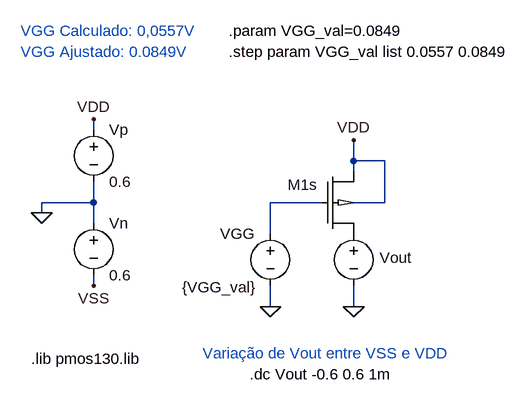
[diagram p0: schematic FiguraA_Questao2.asc]
FiguraA_Questao2.asc, the LTspice schematic file:
Version 4.1
SHEET 1 968 680
WIRE -144 -160 -144 -176
WIRE 256 -112 256 -144
WIRE 304 -112 256 -112
WIRE 256 -96 256 -112
WIRE -144 -48 -144 -80
WIRE -144 -48 -224 -48
WIRE 208 -48 128 -48
WIRE 304 -48 304 -112
WIRE 304 -48 256 -48
WIRE -224 -32 -224 -48
WIRE -144 -16 -144 -48
WIRE 128 0 128 -48
WIRE -144 80 -144 64
WIRE 128 112 128 80
WIRE 256 112 256 80
FLAG -224 -32 0
FLAG -144 80 VSS
FLAG -144 -176 VDD
FLAG 256 -144 VDD
FLAG 128 112 0
FLAG 256 112 0
SYMBOL pmos130 208 -96 R0
WINDOW 0 -53 21 Left 2
WINDOW 3 -99 27 Invisible 2
SYMATTR InstName M1s
SYMATTR SpiceLine width=3462n length=300n
SYMBOL voltage -144 -176 R0
WINDOW 123 0 0 Left 0
WINDOW 39 0 0 Left 0
SYMATTR InstName Vp
SYMATTR Value 0.6
SYMBOL voltage -144 -32 R0
WINDOW 123 0 0 Left 0
WINDOW 39 0 0 Left 0
SYMATTR InstName Vn
SYMATTR Value 0.6
SYMBOL voltage 128 -16 M0
WINDOW 3 22 98 Left 2
SYMATTR Value {VGG_val}
SYMATTR InstName VGG
SYMBOL voltage 256 -16 R0
WINDOW 0 40 53 Left 2
WINDOW 3 24 96 Invisible 2
WINDOW 123 0 0 Left 0
WINDOW 39 0 0 Left 0
SYMATTR InstName Vout
SYMATTR Value 0.6
TEXT -240 192 Left 2 !.lib pmos130.lib
TEXT 96 216 Left 2 !.dc Vout -0.6 0.6 1m
TEXT -256 -312 Left 2 ;VGG Calculado: 0,0557V
TEXT -256 -280 Left 2 ;VGG Ajustado: 0.0849V
TEXT 24 184 Left 2 ;Variação de Vout entre VSS e VDD
TEXT 64 -312 Left 2 !.param VGG_val=0.0849
TEXT 64 -280 Left 2 !.step param VGG_val list 0.0557 0.0849

The netlist it stands for:
* FiguraA_Questao2.asc
X§M1s VDD N001 P001 VDD pmos130 width=3462n length=300n  ; pins D G S B
Vp VDD 0 0.6
Vn 0 VSS 0.6
VGG N001 0 {VGG_val}
Vout P001 0 0.6
.lib pmos130.lib
.dc Vout -0.6 0.6 1m
* VGG Calculado: 0,0557V
* VGG Ajustado: 0.0849V
* Variação de Vout entre VSS e VDD
.param VGG_val=0.0849
.step param VGG_val list 0.0557 0.0849
.backanno
.end